# EasyEDA schematic gcgc.json
TITLE: Sheet_1; REV: 1.0; Date: 2021-07-03; Sheet: 1/1; Company: Your Company
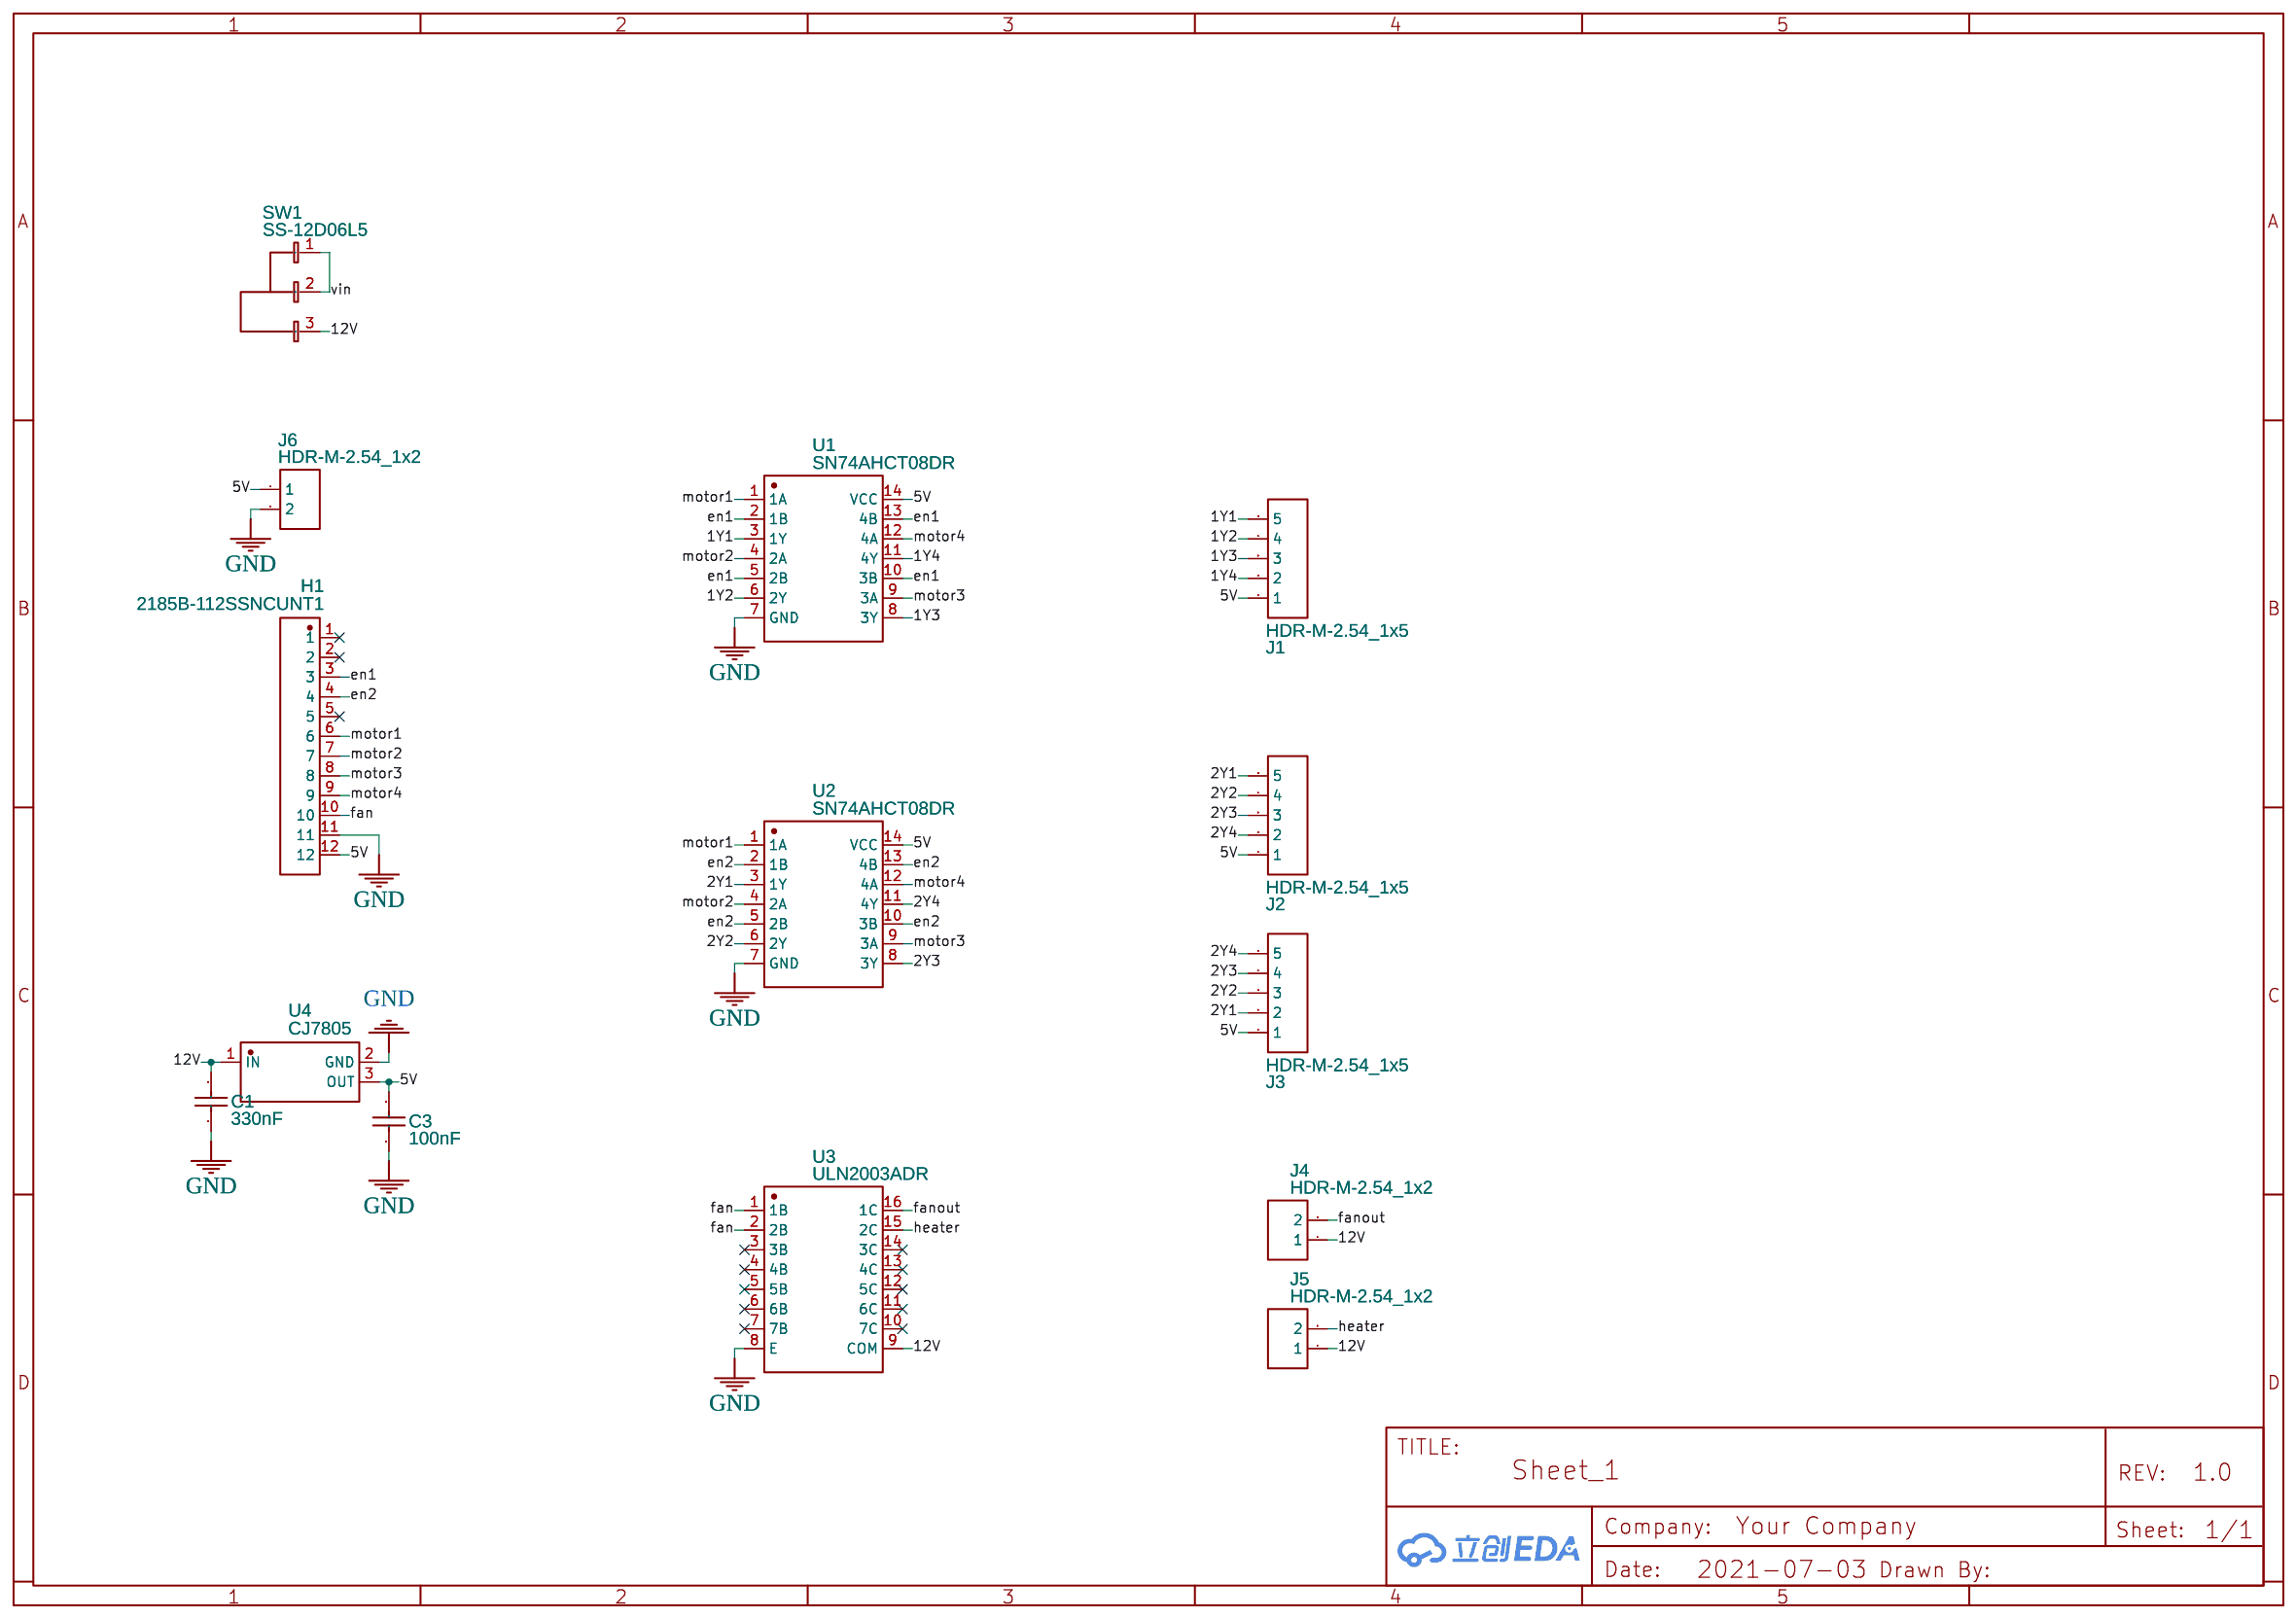
[diagram p0: schematic sheet]

## Parts
C1  330nF  [C0805]
C3  100nF  [C0805]
H1  2185B-112SSNCUNT1  [HDR-TH_12P-P2.54-V-F]
J1  HDR-M-2.54_1x5  [HDR-M-2.54_1X5]
J2  HDR-M-2.54_1x5  [HDR-M-2.54_1X5]
J3  HDR-M-2.54_1x5  [HDR-M-2.54_1X5]
J4  HDR-M-2.54_1x2  [HDR-M-2.54_1X2]
J5  HDR-M-2.54_1x2  [HDR-M-2.54_1X2]
J6  HDR-M-2.54_1x2  [HDR-M-2.54_1X2]
SW1  SS-12D06L5  [SW-TH_3P-P4.70_L11.1-W12.7]
U1  SN74AHCT08DR  [SOIC-14_L8.7-W3.9-P1.27-LS6.0-BL]
U2  SN74AHCT08DR  [SOIC-14_L8.7-W3.9-P1.27-LS6.0-BL]
U3  ULN2003ADR  [SOIC-16_L9.9-W3.9-P1.27-LS6.0-BL]
U4  CJ7805  [TO-263-2_L10.1-W9.1-P5.08-LS15.2-TL]

## Library data of the parts
C1 = 0805B334K500NT: Supplier: LCSC; Manufacturer: FH; Supplier Part: C1740; JLCPCB Part Class: Basic Part
C3 = CC0805KRX7R9BB104: Supplier: LCSC; Manufacturer: YAGEO; Supplier Part: C49678; JLCPCB Part Class: Basic Part
H1 = 2185B-112SSNCUNT1: Supplier: LCSC; Supplier Part: C721800; Manufacturer: Wcon; Contributor: LCSC; JLCPCB Part Class: Extended Part
J1-J3 = HDR-M-2.54_1x5: Supplier Part: C358687; Supplier: LCSC; Contributor: LCEDA_Lib
J4-J6 = HDR-M-2.54_1x2: Supplier Part: C124375; Supplier: LCSC; Contributor: LCEDA_Lib
SW1 = SS-12D06L5: Supplier: LCSC; Supplier Part: C319015; Manufacturer: XKB Enterprise; Contributor: LCSC; Paste Type: expand
U1 U2 = SN74AHCT08DR: Supplier: LCSC; Manufacturer: TI; Supplier Part: C7480; JLCPCB Part Class: Extended Part
U3 = ULN2003ADR: Supplier: LCSC; Manufacturer: TI; Supplier Part: C7512; JLCPCB Part Class: Basic Part
U4 = CJ7805: Supplier: LCSC; Manufacturer: CJ; Contributor: LCSC; Supplier Part: C131137; JLCPCB Part Class: Extended Part

## Nets
5V: C3.1 H1.12 J1.1 J2.1 J3.1 J6.1 U1.14(VCC) U2.14(VCC) U4.3(OUT)
12V: C1.1 J4.1 J5.1 SW1.3 U3.9(COM) U4.1(IN)
GND: C1.2 C3.2 H1.11 J6.2 U1.7(GND) U2.7(GND) U3.8(E) U4.2(GND)
vin: SW1.1 SW1.2
1Y1: J1.5 U1.3(1Y)
1Y2: J1.4 U1.6(2Y)
1Y3: J1.3 U1.8(3Y)
1Y4: J1.2 U1.11(4Y)
2Y1: J2.5 J3.2 U2.3(1Y)
2Y2: J2.4 J3.3 U2.6(2Y)
2Y3: J2.3 J3.4 U2.8(3Y)
2Y4: J2.2 J3.5 U2.11(4Y)
en1: H1.3 U1.2(1B) U1.5(2B) U1.10(3B) U1.13(4B)
en2: H1.4 U2.2(1B) U2.5(2B) U2.10(3B) U2.13(4B)
fan: H1.10 U3.1(1B) U3.2(2B)
fanout: J4.2 U3.16(1C)
heater: J5.2 U3.15(2C)
motor1: H1.6 U1.1(1A) U2.1(1A)
motor2: H1.7 U1.4(2A) U2.4(2A)
motor3: H1.8 U1.9(3A) U2.9(3A)
motor4: H1.9 U1.12(4A) U2.12(4A)

Not connected (* = marked no-connect by the designer): H1 1* 2* 5*; U3 3(3B)* 4(4B)* 5(5B)* 6(6B)* 7(7B)* 10(7C)* 11(6C)* 12(5C)* 13(4C)* 14(3C)*
